# Altium schematic sheet HolderDog_Simetric.SchDoc
size A4; SheetNumber: 1; SheetTotal: 1
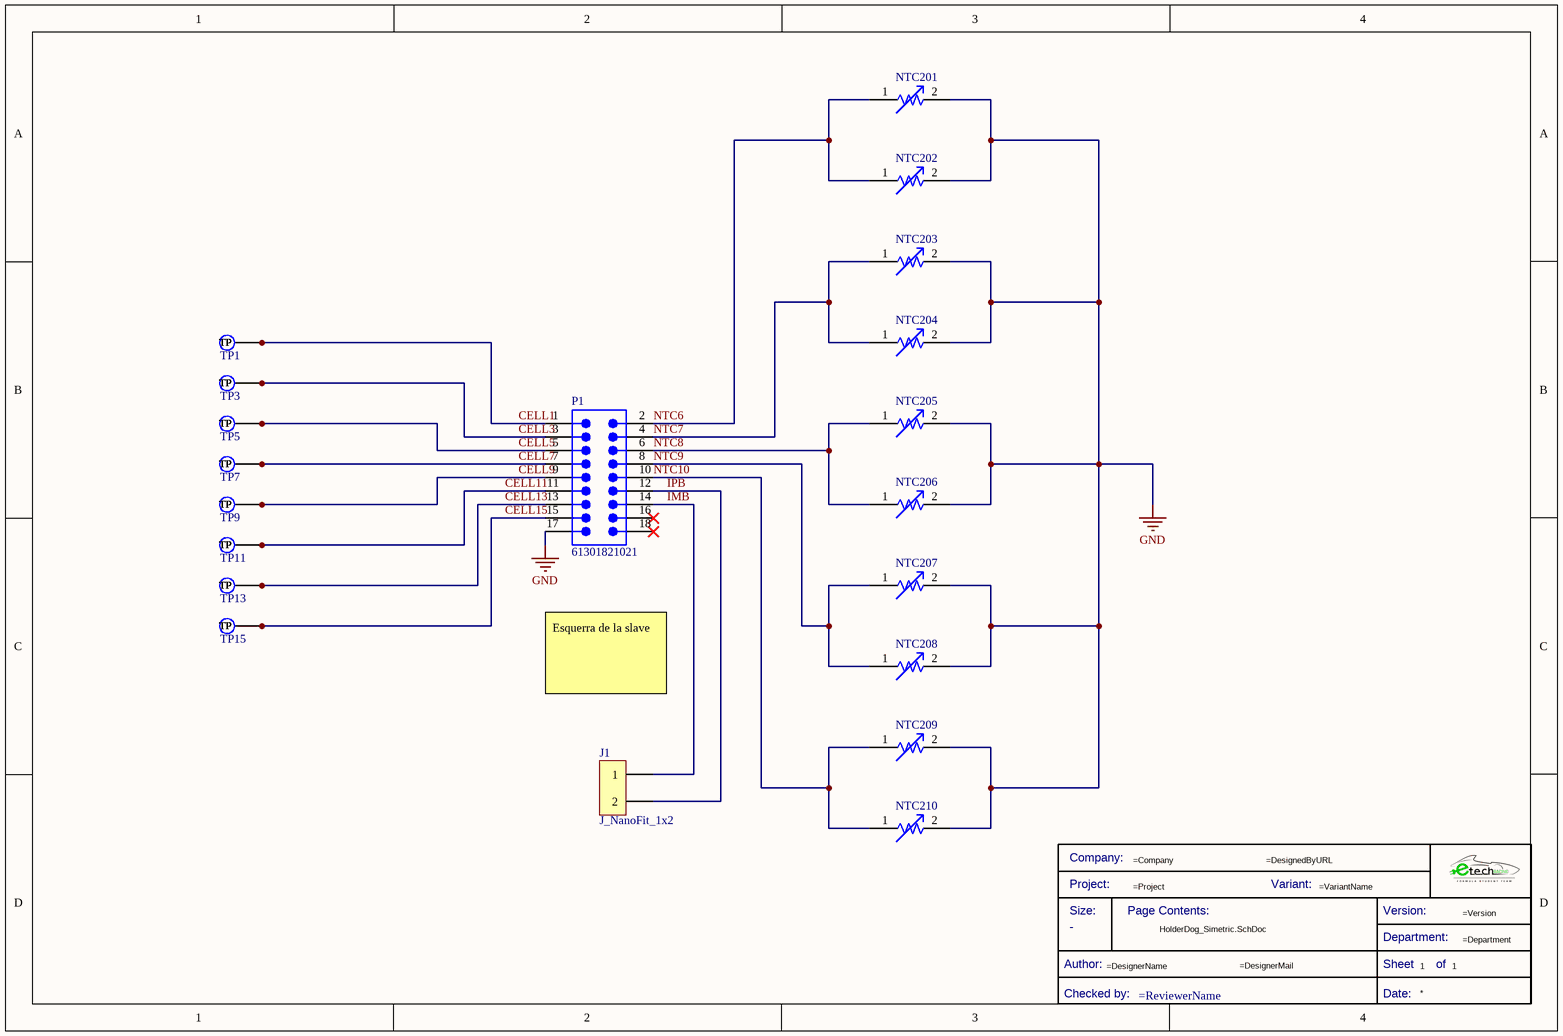
[diagram p0: HolderDog_Simetric.SchDoc]

## Parts
*  Title Block_template  (value not drawn)  (graphical)
J1  J_NanoFit_1x2  [FP-105309-1102-MFG]
NTC201  NTC SMD 0805  [RESC2012X10N]  (value not drawn)
NTC202  NTC SMD 0805  [RESC2012X10N]  (value not drawn)
NTC203  NTC SMD 0805  [RESC2012X10N]  (value not drawn)
NTC204  NTC SMD 0805  [RESC2012X10N]  (value not drawn)
NTC205  NTC SMD 0805  [RESC2012X10N]  (value not drawn)
NTC206  NTC SMD 0805  [RESC2012X10N]  (value not drawn)
NTC207  NTC SMD 0805  [RESC2012X10N]  (value not drawn)
NTC208  NTC SMD 0805  [RESC2012X10N]  (value not drawn)
NTC209  NTC SMD 0805  [RESC2012X10N]  (value not drawn)
NTC210  NTC SMD 0805  [RESC2012X10N]  (value not drawn)
P1  61301821021  [61301821021]
TP1  Test Point  [TESTPOINT_WIDE]  (value not drawn)
TP3  Test Point  [TESTPOINT_WIDE]  (value not drawn)
TP5  Test Point  [TESTPOINT_WIDE]  (value not drawn)
TP7  Test Point  [TESTPOINT_WIDE]  (value not drawn)
TP9  Test Point  [TESTPOINT_WIDE]  (value not drawn)
TP11  Test Point  [TESTPOINT_WIDE]  (value not drawn)
TP13  Test Point  [TESTPOINT_WIDE]  (value not drawn)
TP15  Test Point  [TESTPOINT_WIDE]  (value not drawn)

## Nets
GND: NTC201.2 NTC202.2 NTC203.2 NTC204.2 NTC205.2 NTC206.2 NTC207.2 NTC208.2 NTC209.2 NTC210.2 P1.17
CELL1: P1.1 TP1.1(TP)
CELL3: P1.3 TP3.1(TP)
CELL5: P1.5 TP5.1(TP)
CELL7: P1.7 TP7.1(TP)
CELL9: P1.9 TP9.1(TP)
CELL11: P1.11 TP11.1(TP)
CELL13: P1.13 TP13.1(TP)
CELL15: P1.15 TP15.1(TP)
IMB: J1.1 P1.14
IPB: J1.2 P1.12
NTC6: NTC201.1 NTC202.1 P1.2
NTC7: NTC203.1 NTC204.1 P1.4
NTC8: NTC205.1 NTC206.1 P1.6
NTC9: NTC207.1 NTC208.1 P1.8
NTC10: NTC209.1 NTC210.1 P1.10

Not connected (* = marked no-connect by the designer): P1 16* 18*

## Notes on the sheet
- Esquerra de la slave
- (in symbol Title Block_template) Company:; Project:; Variant:; Size:; Page Contents:; Version:; Department:; Author:; Sheet; of; Checked by:; Date:

## Library data of the parts
* = Title Block_template: Standard Title Block; .Creator: GP; Category: Title Block; .PCBcheck: GP; .SCHcheck: GP; Checked by:: =ReviewerName; Size: -
J1 = CMP-002-00001-2: Conn HDR 2 POS 2.5mm Solder ST Thru-Hole 2 Terminal 1 Port Nano-Fit Tray
NTC201-NTC210 = CMP-010-00001-1: NTC 0805 package 10kR
P1 = CMP-002-00004-1: Board Connector, 18 Contact(s), 2 Row(s), Male, Right Angle, 0.1 inch Pitch, Solder Terminal, Locking, Black Insulator, Plug; RoHS Compliant: Yes; Mounting Technology: Board; Min Operating Temperature: -40°C; Connector Type: BOARD CONNECTOR; Max Operating Temperature: 125°C
TP1 TP3 TP5 TP7 TP9 TP11 TP13 TP15 = TestPoint_Wide: TestPoint 5x5mm